# Altium schematic sheet stm32.SchDoc
size A4
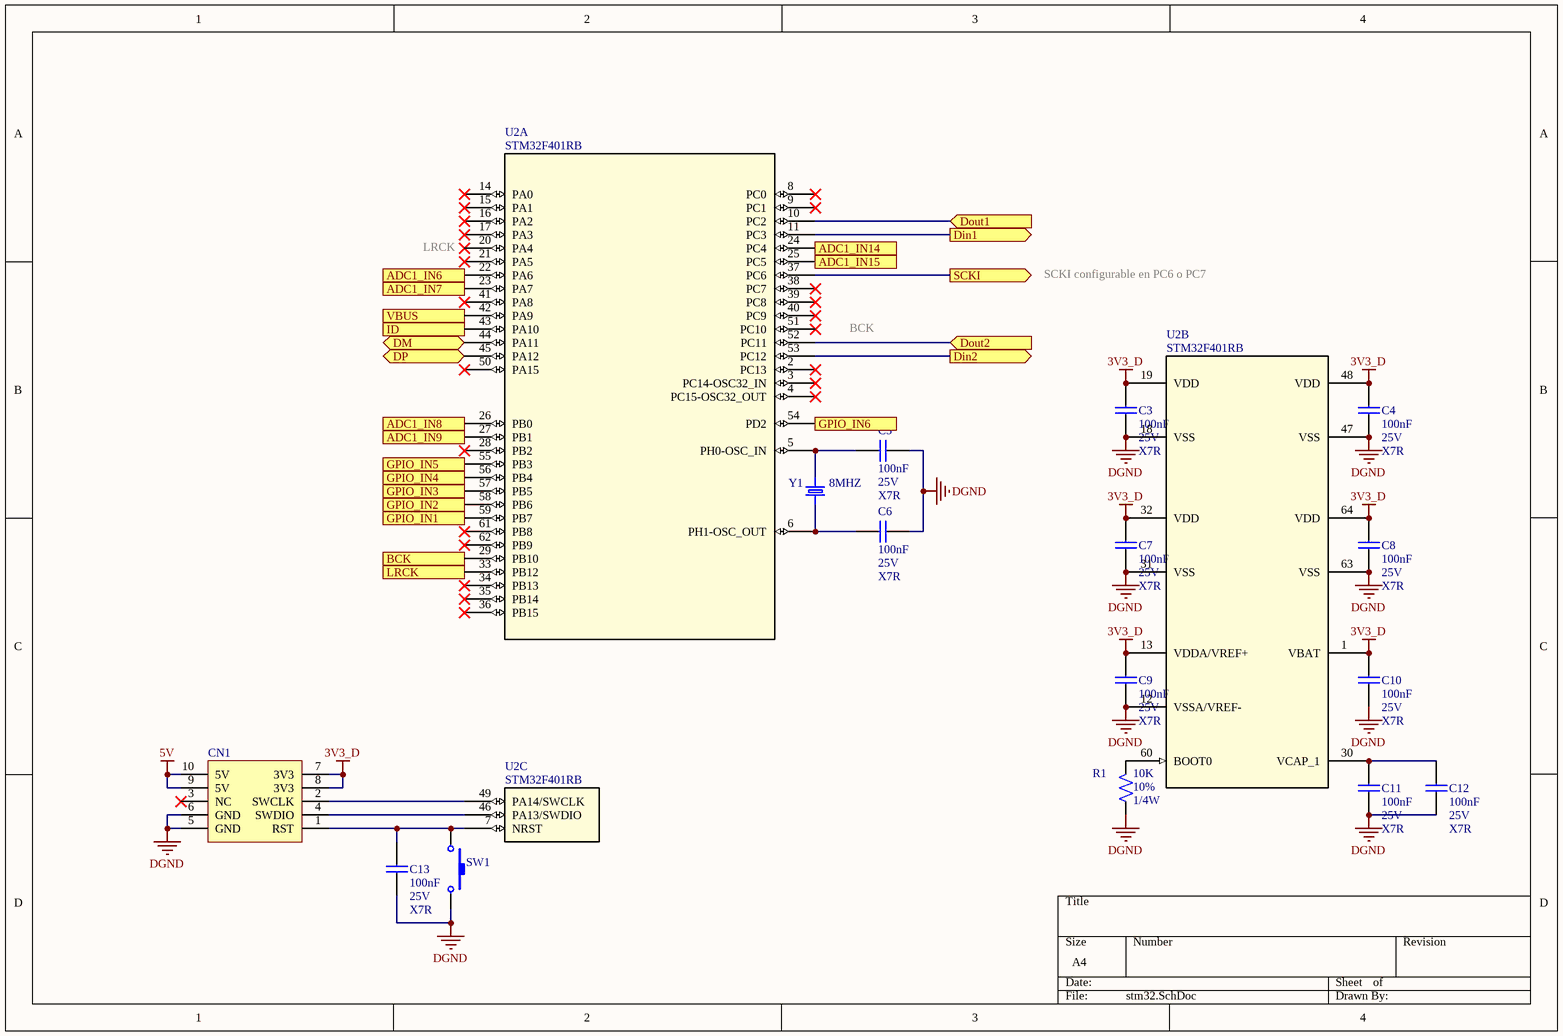
[diagram p0: stm32.SchDoc]

## Parts
C3  valor: 100nF  tension: 25V  tolerancia: X7R  [C0805]  (hidden comment: Capacitor)
C4  valor: 100nF  tension: 25V  tolerancia: X7R  [C0805]  (hidden comment: Capacitor)
C5  valor: 100nF  tension: 25V  tolerancia: X7R  [C0805]  (hidden comment: Capacitor)
C6  valor: 100nF  tension: 25V  tolerancia: X7R  [C0805]  (hidden comment: Capacitor)
C7  valor: 100nF  tension: 25V  tolerancia: X7R  [C0805]  (hidden comment: Capacitor)
C8  valor: 100nF  tension: 25V  tolerancia: X7R  [C0805]  (hidden comment: Capacitor)
C9  valor: 100nF  tension: 25V  tolerancia: X7R  [C0805]  (hidden comment: Capacitor)
C10  valor: 100nF  tension: 25V  tolerancia: X7R  [C0805]  (hidden comment: Capacitor)
C11  valor: 100nF  tension: 25V  tolerancia: X7R  [C0805]  (hidden comment: Capacitor)
C12  valor: 100nF  tension: 25V  tolerancia: X7R  [C0805]  (hidden comment: Capacitor)
C13  valor: 100nF  tension: 25V  tolerancia: X7R  [C0805]  (hidden comment: Capacitor)
CN1  STLINK V2 Mini_2  [IDC10M]  (value not drawn)
R1  Valor: 10K  Potencia: 1/4W  Tolerancia: 10%  [R0805]  (hidden comment: Resistor)
SW1  TAC_SWITCH_4  [TAC_SW_4]  (value not drawn)
U2  STM32F401RB  [LQFP64-10x10mm]  (parts A,B,C of 3)
Y1  frecuencia: 8MHZ  [XTAL_HC49/US_HS]  (hidden comment: XTAL)

## Ports
ADC1_IN6 (in), ADC1_IN7 (in), ADC1_IN8 (in), ADC1_IN9 (in), ADC1_IN14 (in), ADC1_IN15 (in), BCK (out), Din1 (out), Din2 (out), DM (bidir), Dout1 (in), Dout2 (in), DP (bidir), GPIO_IN1 (in), GPIO_IN2 (in), GPIO_IN3 (in), GPIO_IN4 (in), GPIO_IN5 (in), GPIO_IN6 (in), ID (out), LRCK (out), SCKI (out), VBUS (in)

## Nets
3V3_D: C3.1 C4.1 C7.1 C8.1 C9.1 C10.1 CN1.7(3V3) CN1.8(3V3) U2.1(VBAT) U2.13(VDDA/VREF+) U2.19(VDD) U2.32(VDD) U2.48(VDD) U2.64(VDD)
5V: CN1.9(5V) CN1.10(5V)
DGND: C3.2 C4.2 C5.1 C6.1 C7.2 C8.2 C9.2 C10.2 C11.2 C12.2 C13.2 CN1.5(GND) CN1.6(GND) R1.1 SW1.2 U2.12(VSSA/VREF-) U2.18(VSS) U2.31(VSS) U2.47(VSS) U2.63(VSS)
ADC1_IN6: U2.22(PA6) ; port ADC1_IN6
ADC1_IN7: U2.23(PA7) ; port ADC1_IN7
ADC1_IN8: U2.26(PB0) ; port ADC1_IN8
ADC1_IN9: U2.27(PB1) ; port ADC1_IN9
ADC1_IN14: U2.24(PC4) ; port ADC1_IN14
ADC1_IN15: U2.25(PC5) ; port ADC1_IN15
BCK: U2.29(PB10) ; port BCK
Din1: U2.11(PC3) ; port Din1
Din2: U2.53(PC12) ; port Din2
DM: U2.44(PA11) ; port DM
Dout1: U2.10(PC2) ; port Dout1
Dout2: U2.52(PC11) ; port Dout2
DP: U2.45(PA12) ; port DP
GPIO_IN1: U2.59(PB7) ; port GPIO_IN1
GPIO_IN2: U2.58(PB6) ; port GPIO_IN2
GPIO_IN3: U2.57(PB5) ; port GPIO_IN3
GPIO_IN4: U2.56(PB4) ; port GPIO_IN4
GPIO_IN5: U2.55(PB3) ; port GPIO_IN5
GPIO_IN6: U2.54(PD2) ; port GPIO_IN6
ID: U2.43(PA10) ; port ID
LRCK: U2.33(PB12) ; port LRCK
SCKI: U2.37(PC6) ; port SCKI
VBUS: U2.42(PA9) ; port VBUS
NetC5_2: C5.2 U2.5(PH0-OSC_IN) Y1.1
NetC6_2: C6.2 U2.6(PH1-OSC_OUT) Y1.2
NetC11_1: C11.1 C12.1 U2.30(VCAP_1)
NetC13_1: C13.1 CN1.1(RST) SW1.1 U2.7(NRST)
NetCN1_2: CN1.2(SWCLK) U2.49(PA14/SWCLK)
NetCN1_4: CN1.4(SWDIO) U2.46(PA13/SWDIO)
NetR1_2: R1.2 U2.60(BOOT0)

Not connected (* = marked no-connect by the designer): CN1 3(NC)*; U2 2(PC13)* 3(PC14-OSC32_IN)* 4(PC15-OSC32_OUT)* 8(PC0)* 9(PC1)* 14(PA0)* 15(PA1)* 16(PA2)* 17(PA3)* 20(PA4)* 21(PA5)* 28(PB2)* 34(PB13)* 35(PB14)* 36(PB15)* 38(PC7)* 39(PC8)* 40(PC9)* 41(PA8)* 50(PA15)* 51(PC10)* 61(PB8)* 62(PB9)*

## Notes on the sheet
- LRCK
- SCKI configurable en PC6 o PC7
- BCK

## Library data of the parts
C3-C13 = Capacitor: Capacitor de placas paralelas; Encapsulado: 0805
CN1 = STLINK V2 Mini_2: STLINK V2 Mini; Link: *; Fabricante: *
R1 = Resistor: Resistencia
SW1 = TAC_SWITCH_4: Pulsador de 4 pines
U2 = STM32F4xxR2: Vendor: STMicroelectronics; _BOOT0=1: 1: System memory is selected as boot space; _BOOT0=0: 0: Main Flash memory is selected as boot space; _VDD: Capa de 100nF; _BOOT0: conectado a VDD o DGND a traves de R=10K; Proveedor: Digi-Key; Cod. Proveedor: 497-17428-ND; Encapsulado: 64-LQFP; Manufacturer_Part_Number: stm32f4xxr2; Value: Value; Link: https://www.digikey.com/product-detail/es/STM32F401RBT6/497-17428-ND/4755972?utm_campaign=buynow&WT.z_cid=ref_octopart_dkc_buynow&utm_medium=aggregator&curr=usd&site=us&utm_source=octopart; Manufacturer: STMicroelectronics
Y1 = XTAL: Resonador cerámico